# EAGLE schematic VoltageSensingBoard (EAGLE 8.3.2)
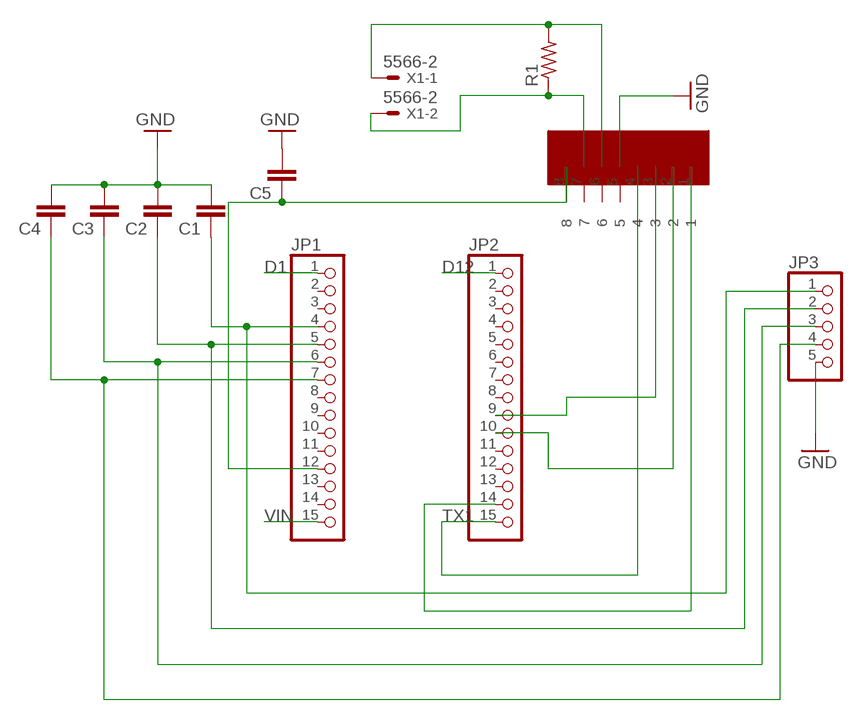
[diagram p0: schematic, sheet 1]

## Parts
C1  C5/2.5  [C5B2.5]
C2  C5/2.5  [C5B2.5]
C3  C5/2.5  [C5B2.5]
C4  C5/2.5  [C5B2.5]
C5  C5/2.5  [C5B2.5]
JP1  PINHD-1X15  [1X15]
JP2  PINHD-1X15  [1X15]
JP3  PINHD-1X5  [1X05]
R1  R-US_0204/7  [0204/7]
U$1  THVD1550  [SO08]
X1  5566-2  [5566-2]

## Nets
D1: JP1.1
D12: JP2.1
GND: C1.2 C2.2 C3.2 C4.2 C5.2 JP3.5 U$1.5
N$1: C1.1 JP1.4 JP3.1
N$3: C3.1 JP1.6 JP3.3
N$4: C4.1 JP1.7 JP3.4
N$5: R1.2 U$1.6 X1.1
N$6: R1.1 U$1.7 X1.2
N$7: C2.1 JP1.5 JP3.2
N$8: C5.1 JP1.12 U$1.8
N$9: JP2.10 U$1.2
N$10: JP2.14 U$1.1
N$11: JP2.9 U$1.3
TX1: JP2.15 U$1.4
VIN: JP1.15
Unconnected: JP1.2 JP1.3 JP1.8 JP1.9 JP1.10 JP1.11 JP1.13 JP1.14 JP2.2 JP2.3 JP2.4 JP2.5 JP2.6 JP2.7 JP2.8 JP2.11 JP2.12 JP2.13

## Library data of the parts
C1-C5 = capacitor-wima:C: CAPACITOR naming: grid - package width
JP1 JP2 = pinhead:PINHD-1X15: PIN HEADER
JP3 = pinhead:PINHD-1X5: PIN HEADER
R1 = resistor:R-US_: RESISTOR, American symbol
U$1 = Custom:THVD1550
X1 = con-molex:5566-2: Mini FIT connector 2 pol Source: http://www.molex.com; OC_FARNELL: 1822072; OC_NEWARK: unknown